# EAGLE schematic esquema (EAGLE 9.5.2)
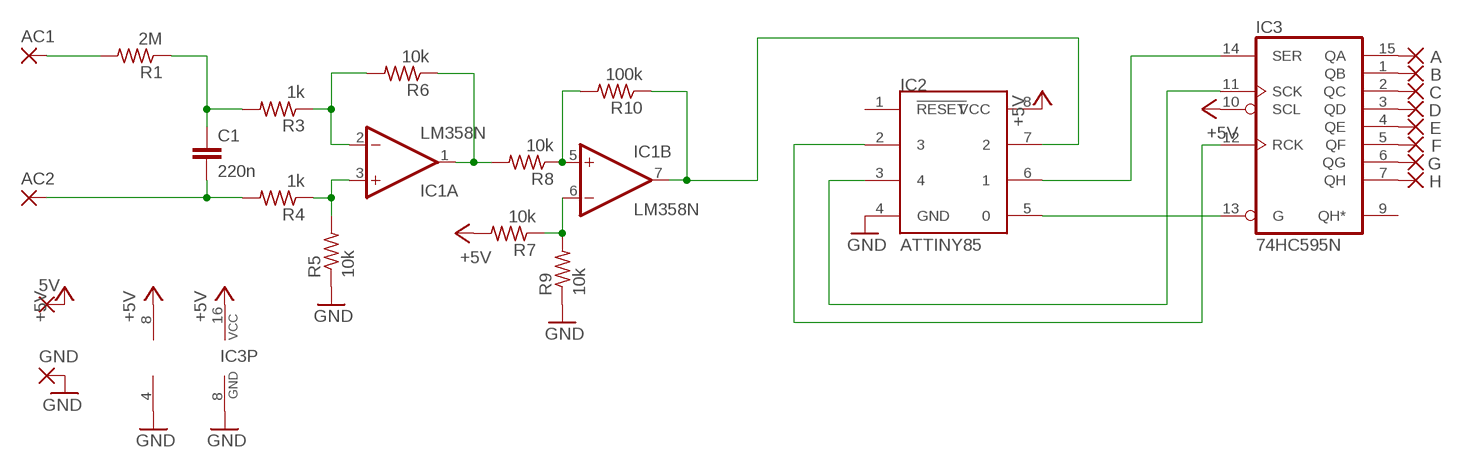
[diagram p0: schematic, sheet 1]

## Parts
5V  2,15/1,0  [2,15/1,0]
A  2,15/1,0  [2,15/1,0]
AC1  2,15/1,0  [2,15/1,0]
AC2  2,15/1,0  [2,15/1,0]
B  2,15/1,0  [2,15/1,0]
C  2,15/1,0  [2,15/1,0]
C1  220n  C-EU075-052X106  [C075-052X106]
D  2,15/1,0  [2,15/1,0]
E  2,15/1,0  [2,15/1,0]
F  2,15/1,0  [2,15/1,0]
G  2,15/1,0  [2,15/1,0]
GND  2,15/1,0  [2,15/1,0]
H  2,15/1,0  [2,15/1,0]
IC1  LM358N  [DIL08]
IC2  ATTINY85  [8P3]
IC3  74HC595N  [DIL16]
R1  2M  R-US_0207/10  [0207/10]
R3  1k  R-US_0207/10  [0207/10]
R4  1k  R-US_0207/10  [0207/10]
R5  10k  R-US_0207/10  [0207/10]
R6  10k  R-US_0207/10  [0207/10]
R7  10k  R-US_0207/10  [0207/10]
R8  10k  R-US_0207/10  [0207/10]
R9  10k  R-US_0207/10  [0207/10]
R10  100k  R-US_0207/10  [0207/10]

## Nets
+5V: 5V.1(P) IC1.8(P:V+) IC2.8(VCC) IC3.10(SCL) IC3.16(VCC) R7.2
GND: GND.1(P) IC1.4(P:V-) IC2.4(GND) IC3.8(GND) R5.1 R9.1
N$1: AC1.1(P) R1.2
N$2: C1.1 R1.1 R3.2
N$4: AC2.1(P) C1.2 R4.2
N$5: IC1.3(A:+IN) R4.1 R5.2
N$6: IC1.2(A:-IN) R3.1 R6.2
N$7: IC1.5(B:+IN) R8.1 R10.2
N$8: IC1.1(A:OUT) R6.1 R8.2
N$9: IC1.6(B:-IN) R7.1 R9.2
N$10: IC2.5 IC3.13(G)
N$11: IC1.7(B:OUT) IC2.7 R10.1
N$12: IC2.6 IC3.14(SER)
N$13: IC2.2 IC3.12(RCK)
N$14: A.1(P) IC3.15(QA)
N$15: IC2.3 IC3.11(SCK)
N$16: B.1(P) IC3.1(QB)
N$17: C.1(P) IC3.2(QC)
N$18: D.1(P) IC3.3(QD)
N$19: E.1(P) IC3.4(QE)
N$20: F.1(P) IC3.5(QF)
N$21: G.1(P) IC3.6(QG)
N$22: H.1(P) IC3.7(QH)
Unconnected: IC2.1(!RESET) IC3.9(QH*)

## Library data of the parts
5V A AC1 AC2 B C D E F G GND H = wirepad:2,15/1,0: THROUGH-HOLE PAD
C1 = rcl:C-EU: CAPACITOR, European symbol; SPICEPREFIX: C
IC1 = linear:LM358: OP AMP also LM158; LM258; LM2904 Source: http://cache.national.com/ds/LM/LM158.pdf
IC2 = attiny85:ATTINY85
IC3 = 74xx-eu:74*595: 8-bit SHIFT REGISTER, output latch
R1 R3-R10 = rcl:R-US_: RESISTOR, American symbol; SPICEPREFIX: R